# EAGLE design TriggerBoard (EAGLE 6.5.0)
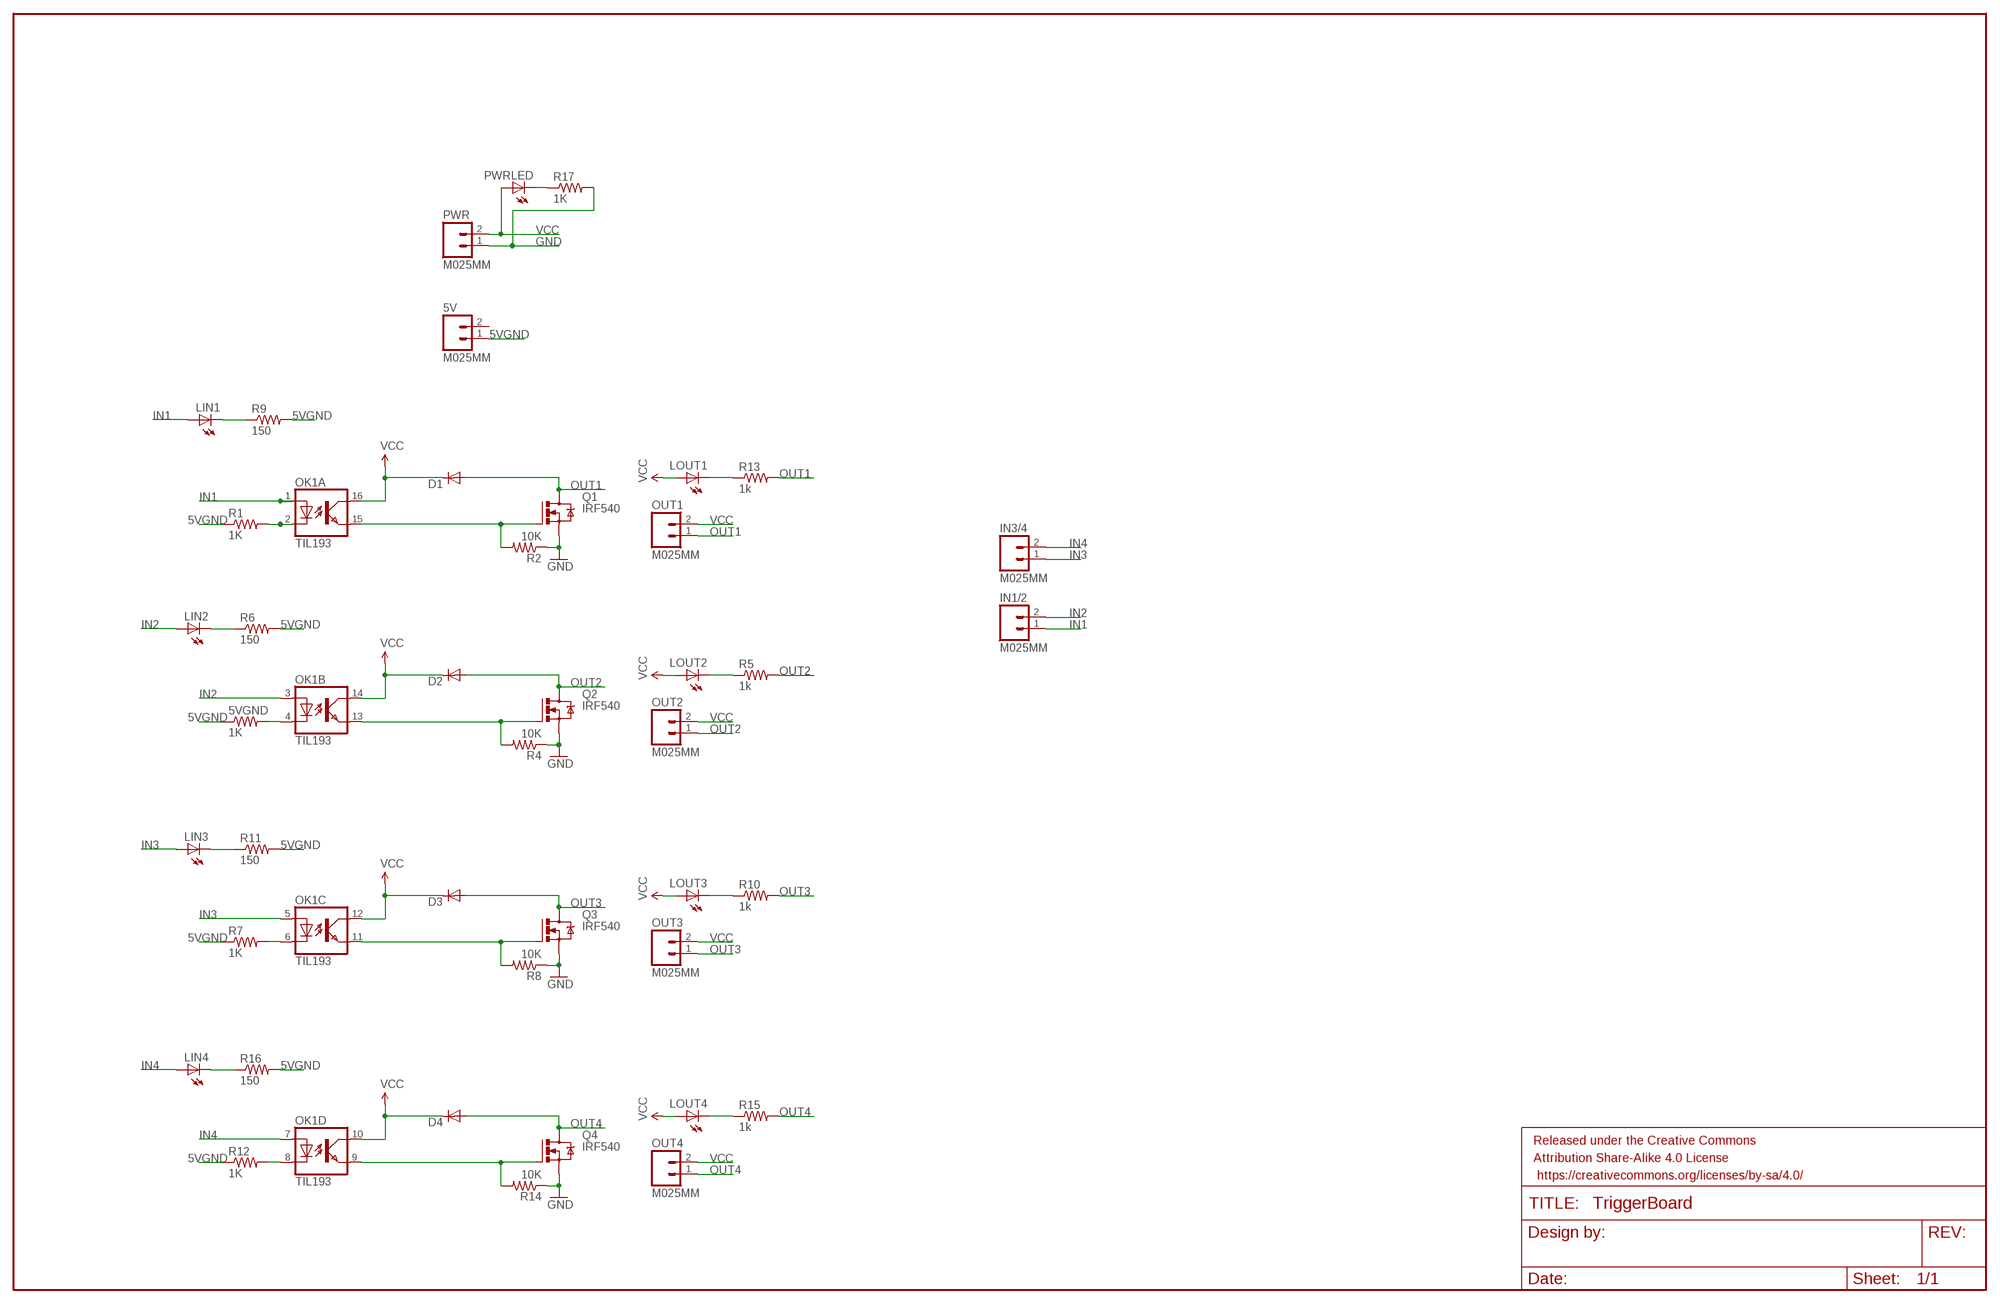
[diagram p0: schematic, sheet 1]

## Parts
5V  M025MM  [SCREWTERMINAL-5MM-2]
5VGND  1K  RESISTORPTH-1/4W  [AXIAL-0.4]
D1  DIODEPTH  [DIODE-1N4001]
D2  DIODEPTH  [DIODE-1N4001]
D3  DIODEPTH  [DIODE-1N4001]
D4  DIODEPTH  [DIODE-1N4001]
FRAME1  FRAME-LEDGER  [CREATIVE_COMMONS]
IN1/2  M025MM  [SCREWTERMINAL-5MM-2]
IN3/4  M025MM  [SCREWTERMINAL-5MM-2]
LIN1  LED3MM  [LED3MM]
LIN2  LED3MM  [LED3MM]
LIN3  LED3MM  [LED3MM]
LIN4  LED3MM  [LED3MM]
LOUT1  LED3MM  [LED3MM]
LOUT2  LED3MM  [LED3MM]
LOUT3  LED3MM  [LED3MM]
LOUT4  LED3MM  [LED3MM]
OK1  TIL193  [DIL16]
OUT1  M025MM  [SCREWTERMINAL-5MM-2]
OUT2  M025MM  [SCREWTERMINAL-5MM-2]
OUT3  M025MM  [SCREWTERMINAL-5MM-2]
OUT4  M025MM  [SCREWTERMINAL-5MM-2]
PWR  M025MM  [SCREWTERMINAL-5MM-2]
PWRLED  LED5MM  [LED5MM]
Q1  IRF540  [TO220BV]
Q2  IRF540  [TO220BV]
Q3  IRF540  [TO220BV]
Q4  IRF540  [TO220BV]
R1  1K  RESISTORPTH-1/4W  [AXIAL-0.4]
R2  10K  RESISTORPTH-1/4W  [AXIAL-0.4]
R4  10K  RESISTORPTH-1/4W  [AXIAL-0.4]
R5  1k  RESISTORPTH-1/4W  [AXIAL-0.4]
R6  150  RESISTORPTH-1/4W  [AXIAL-0.4]
R7  1K  RESISTORPTH-1/4W  [AXIAL-0.4]
R8  10K  RESISTORPTH-1/4W  [AXIAL-0.4]
R9  150  RESISTORPTH-1/4W  [AXIAL-0.4]
R10  1k  RESISTORPTH-1/4W  [AXIAL-0.4]
R11  150  RESISTORPTH-1/4W  [AXIAL-0.4]
R12  1K  RESISTORPTH-1/4W  [AXIAL-0.4]
R13  1k  RESISTORPTH-1/4W  [AXIAL-0.4]
R14  10K  RESISTORPTH-1/4W  [AXIAL-0.4]
R15  1k  RESISTORPTH-1/4W  [AXIAL-0.4]
R16  150  RESISTORPTH-1/4W  [AXIAL-0.4]
R17  1K  RESISTORPTH-1/4W  [AXIAL-0.4]

## Nets
5VGND: 5V.1 5VGND.P$1 R1.P$1 R6.P$2 R7.P$1 R9.P$2 R11.P$2 R12.P$1 R16.P$2
GND: PWR.1 Q1.S Q2.S Q3.S Q4.S R2.P$1 R4.P$1 R8.P$1 R14.P$1 R17.P$2
IN1: IN1/2.1 LIN1.A OK1.1(A:A)
IN2: IN1/2.2 LIN2.A OK1.3(B:A)
IN3: IN3/4.1 LIN3.A OK1.5(C:A)
IN4: IN3/4.2 LIN4.A OK1.7(D:A)
N$1: LOUT1.K(C) R13.P$1
N$2: 5VGND.P$2 OK1.4(B:C)
N$3: LIN1.K(C) R9.P$1
N$4: OK1.15(A:EMIT) Q1.G R2.P$2
N$5: OK1.13(B:EMIT) Q2.G R4.P$2
N$6: OK1.2(A:C) R1.P$2
N$7: LOUT2.K(C) R5.P$1
N$8: LIN2.K(C) R6.P$1
N$9: OK1.11(C:EMIT) Q3.G R8.P$2
N$10: LOUT3.K(C) R10.P$1
N$11: OK1.6(C:C) R7.P$2
N$12: LIN3.K(C) R11.P$1
N$13: OK1.9(D:EMIT) Q4.G R14.P$2
N$14: LOUT4.K(C) R15.P$1
N$15: OK1.8(D:C) R12.P$2
N$16: LIN4.K(C) R16.P$1
N$17: PWRLED.K(C) R17.P$1
OUT1: D1.A OUT1.1 Q1.D R13.P$2
OUT2: D2.A OUT2.1 Q2.D R5.P$2
OUT3: D3.A OUT3.1 Q3.D R10.P$2
OUT4: D4.A OUT4.1 Q4.D R15.P$2
VCC: D1.C D2.C D3.C D4.C LOUT1.A LOUT2.A LOUT3.A LOUT4.A OK1.10(D:COL) OK1.12(C:COL) OK1.14(B:COL) OK1.16(A:COL) OUT1.2 OUT2.2 OUT3.2 OUT4.2 PWR.2 PWRLED.A
Unconnected: 5V.2

## Library data of the parts
5V IN1/2 IN3/4 OUT1-OUT4 PWR = SparkFun-Connectors:M02: Standard 2-pin 0.1" header. Use with - straight break away headers ( PRT-00116) - right angle break away headers (PRT-00553) - swiss pins (PRT-00743) - machine pins (PRT-00117) - female headers (PRT-00115) Molex polarized connector foot print use with: PRT-08233 with associated crimp pins and housings. 2.54_SCREWTERM for use with PRT-10571. 3.5mm Screw Terminal footprints for PRT-08084 5mm Screw Terminal footprints for use with PRT-08433
5VGND R1 R2 R4-R17 = SparkFun-Resistors:RESISTOR: Resistor Basic schematic elements and footprints for 0603, 1206, and PTH resistors.
D1-D4 = SparkFun-DiscreteSemi:DIODE: Diode These are standard reverse protection diodes and small signal diodes. SMA package can handle up to about 1A. SOD-323 can handle about 200mA. What the SOD-323 package when ordering, there are some mfgs out there that are 5-pin packages.
FRAME1 = SparkFun-Aesthetics:FRAME-LEDGER: Schematic Frame Standard 11x14 US Ledger frame
LIN1-LIN4 LOUT1-LOUT4 PWRLED = SparkFun-LED:LED: LEDs Standard schematic elements and footprints for 5mm, 3mm, 1206, and 0603 sized LEDs. 5mm - Spark Fun Electronics SKU : COM-00529 (and others)
OK1 = optocoupler:TIL193: TEXAS INSTRUMENTS OPTO COUPLER; OC_FARNELL: 1683365; OC_NEWARK: unknown
Q1-Q4 = transistor-power:IRF540: HEXFET Power MOSFET

## Board
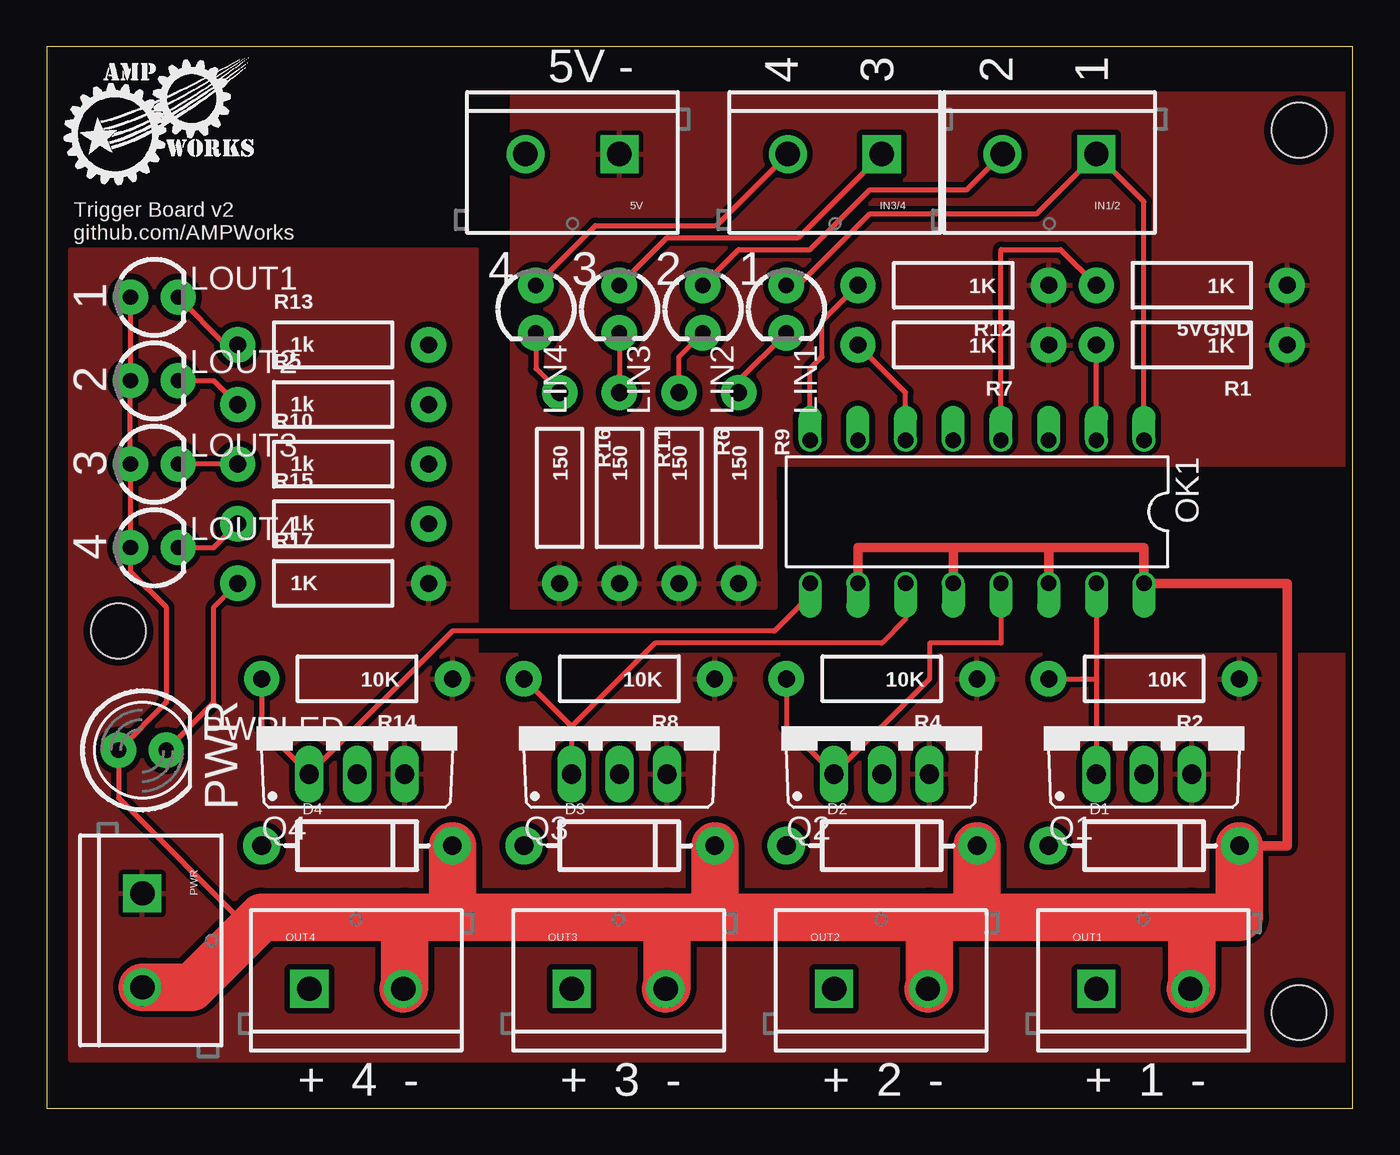
[diagram p1: board, top side]
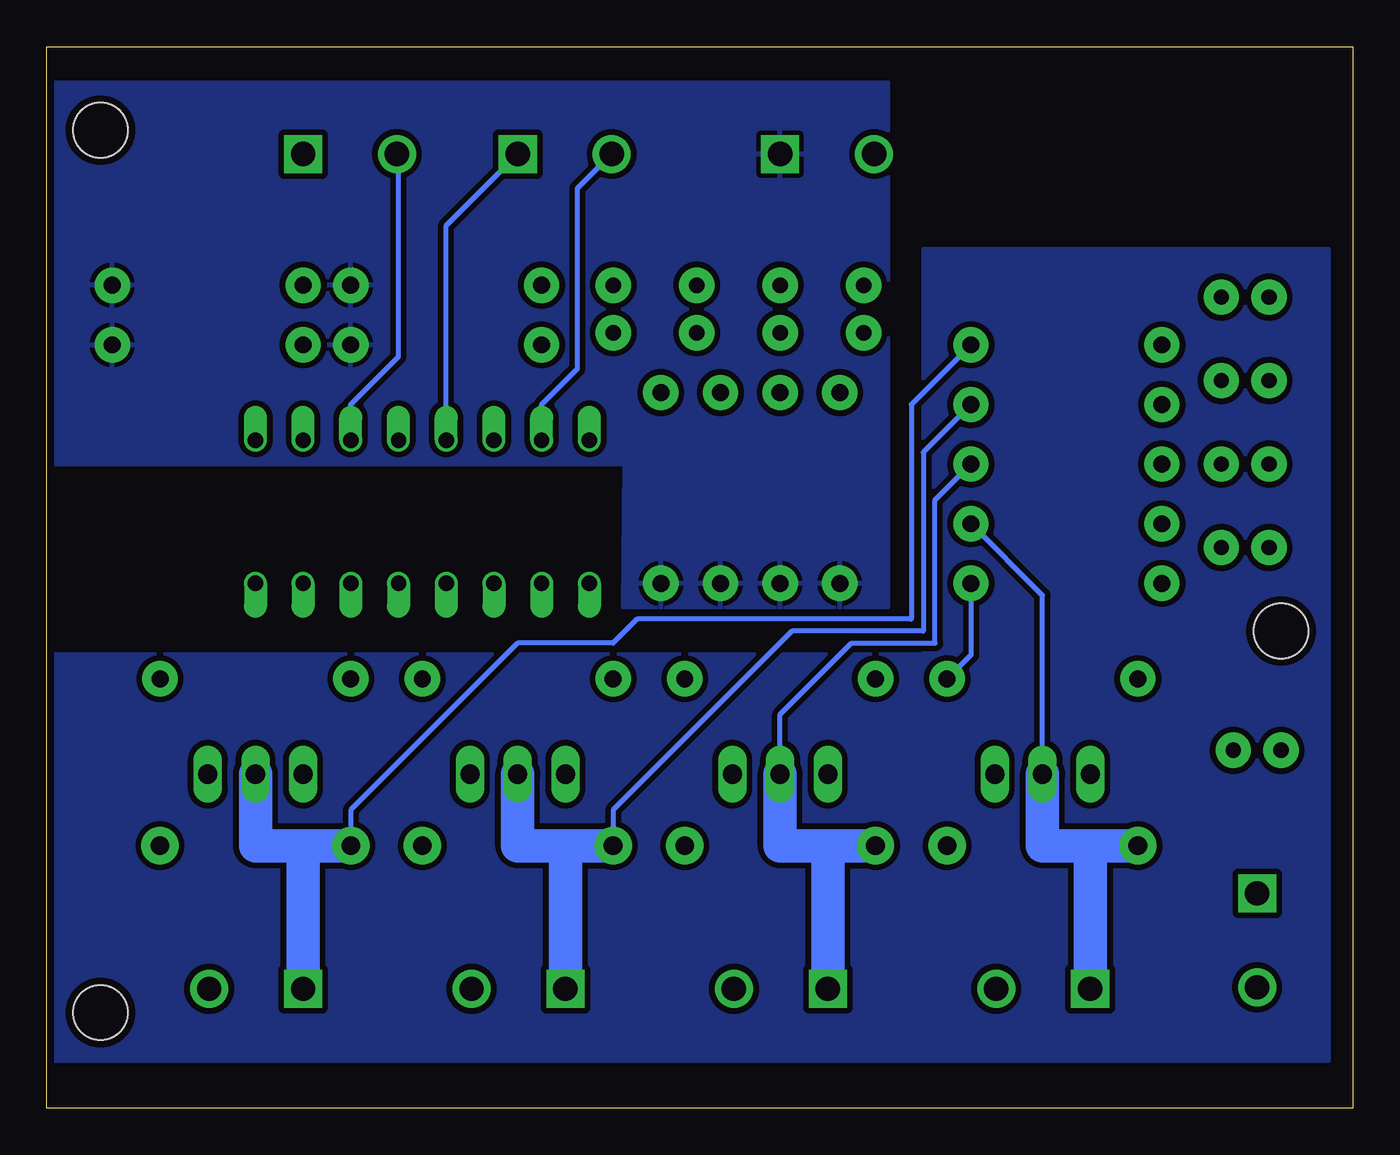
[diagram p2: board, bottom side, seen from below]

Size 69.52 x 56.51 mm. Coordinates in mm from the lower left corner, seen from the top.
Outline: 0,0 69.52,0 69.52,56.51 0,56.51 0,0
Copper layers (1*16): Top 0.0356mm / dielectric 1.5011mm / Bottom 0.0356mm
Design rules "OSHParkDesignRules": minimum track width 6mil, minimum drill 13mil, track to track 6mil, track to pad 6mil, pad to pad 6mil, via to via 6mil, smd to smd 6mil, copper to edge 15mil, drill to drill 6mil, minimum pad ring 7mil, minimum via ring 7mil, stop-mask expansion 3mil, vias tented up to drill 0mil, thermal gap 10mil
Holes 2.92 mm at 66.67,52.07 66.67,5.08 3.81,25.4

### Footprints (pad centres in the part's own frame; a part is rotated, then mirrored left to right if it is on the bottom)
SCREWTERMINAL-5MM-2 = drill 1.3 pad 2.032 square: 1 0,0 | drill 1.3 pad 2.032: 2 5,0
AXIAL-0.4 = drill 0.9 pad 1.88: P$1 -5.08,0; P$2 5.08,0
DIODE-1N4001 = drill 1 pad 1.981: A -5.08,0; C 5.08,0
LED3MM = drill 0.813 pad 1.88: A -1.27,0; K 1.27,0
DIL16 = drill 0.813 offset: 1 -8.89,-3.81; 2 -6.35,-3.81; 3 -3.81,-3.81; 4 -1.27,-3.81; 5 1.27,-3.81; 6 3.81,-3.81; 7 6.35,-3.81; 8 8.89,-3.81; 9 8.89,3.81; 10 6.35,3.81; 11 3.81,3.81; 12 1.27,3.81; 13 -1.27,3.81; 14 -3.81,3.81; 15 -6.35,3.81; 16 -8.89,3.81
LED5MM = drill 0.813 pad 1.88: A -1.27,0; K 1.27,0
TO220BV = drill 1.016 long: D 0,-2.54; G -2.54,-2.54; S 2.54,-2.54

### Placement (x,y rotation side)
5V  30.48,50.8 180 top
5VGND  60.96,43.81 180 top
D1  58.42,13.97 0 top
D2  44.45,13.97 0 top
D3  30.48,13.97 0 top
D4  16.51,13.97 0 top
FRAME1  27.94,-8.89 0 top  (outside the outline)
IN1/2  55.88,50.8 180 top
IN3/4  44.45,50.8 180 top
LIN1  39.37,42.55 270 top
LIN2  34.93,42.55 270 top
LIN3  30.48,42.55 270 top
LIN4  26.04,42.55 270 top
LOUT1  5.71,43.18 0 top
LOUT2  5.71,38.73 0 top
LOUT3  5.71,34.29 0 top
LOUT4  5.71,29.84 0 top
OK1  49.53,31.75 180 top
OUT1  55.88,6.35 0 top
OUT2  41.91,6.35 0 top
OUT3  27.94,6.35 0 top
OUT4  13.97,6.35 0 top
PWR  5.08,11.43 270 top
PWRLED  5.08,19.05 0 top
Q1  58.42,20.32 0 top
Q2  44.45,20.32 0 top
Q3  30.48,20.32 0 top
Q4  16.51,20.32 0 top
R1  60.96,40.64 180 top
R2  58.42,22.86 180 top
R4  44.45,22.86 180 top
R5  15.24,37.46 0 top
R6  33.66,33.02 270 top
R7  48.26,40.64 180 top
R8  30.48,22.86 180 top
R9  36.83,33.02 270 top
R10  15.24,34.29 0 top
R11  30.48,33.02 270 top
R12  48.26,43.81 180 top
R13  15.24,40.64 0 top
R14  16.51,22.86 180 top
R15  15.24,31.11 0 top
R16  27.3,33.02 270 top
R17  15.24,27.94 0 top

### Tracks (layer width: path | path; a pad name or v marks a point on that pad's centre or on a via)
5VGND
  pour Top (isolate 0.305): 24.77,26.67 38.79,26.67 38.74,34.29 69.21,34.29 69.21,53.98 24.77,53.98
  pour Bottom (isolate 0.305): 24.77,26.67 38.81,26.64 38.74,34.29 69.21,34.29 69.21,54.61 24.77,54.61
GND
  Bottom 0.254: R17.P$2 20.32,24.13 R14.P$1
  pour Top (isolate 0.305): 1.27,45.72 22.86,45.72 22.86,24.13 69.21,24.13 69.21,2.54 1.27,2.54
IN1
  Top 0.254: LIN1.A 40.01,43.81 43.82,47.62 52.71,47.62 IN1/2.1 58.42,48.26 OK1.1
IN2
  Top 0.254: LIN2.A 36.83,45.72 40.64,45.72 43.82,48.89 48.98,48.89 IN1/2.2
  Bottom 0.254: OK1.3 53.34,37.46 50.8,40.01 50.8,50.72 IN1/2.2
IN3
  Top 0.254: LIN3.A 33.02,46.35 40.01,46.35 IN3/4.1
  Bottom 0.254: OK1.5 48.26,46.99 IN3/4.1
IN4
  Top 0.254: LIN4.A 29.21,46.99 35.64,46.99 IN3/4.2
  Bottom 0.254: OK1.7 43.18,37.46 41.28,39.37 41.28,48.98 IN3/4.2
N$1
  Top 0.254: R13.P$1 9.53,40.64 LOUT1.K
N$2
  Top 0.254: OK1.4 50.8,45.72 53.98,45.72 5VGND.P$2
N$3
  Top 0.254: R9.P$1 36.83,38.73 LIN1.K
N$4
  Top 0.254: OK1.15 55.88,22.86 | 55.88,22.86 Q1.G | R2.P$2 55.88,22.86
N$5
  Top 0.254: OK1.13 50.8,24.77 46.99,24.77 46.99,22.86 Q2.G 39.37,20.32 R4.P$2
N$6
  Top 0.254: OK1.2 R1.P$2
N$7
  Top 0.254: LOUT2.K 8.89,38.73 R5.P$1
N$8
  Top 0.254: R6.P$1 33.66,40.01 LIN2.K
N$9
  Top 0.254: OK1.11 45.72,26.04 44.45,24.77 32.38,24.77 27.94,20.32 | 27.94,20.32 Q3.G | R8.P$2 27.94,20.32
N$10
  Top 0.254: R10.P$1 LOUT3.K
N$11
  Top 0.254: OK1.6 45.72,38.1 R7.P$2
N$12
  Top 0.254: LIN3.K R11.P$1
N$13
  Top 0.254: OK1.9 40.64,27.3 38.74,25.4 21.59,25.4 Q4.G 11.43,20.32 R14.P$2
N$14
  Top 0.254: LOUT4.K 8.89,29.84 R15.P$1
N$15
  Top 0.254: OK1.8 40.64,39.37 41.28,40.01 41.28,41.91 R12.P$2
N$16
  Top 0.254: LIN4.K 26.04,39.37 R16.P$1
N$17
  Top 0.254: PWRLED.K 8.89,21.59 8.89,26.67 R17.P$1
N$18
  pour Bottom (isolate 0.305): 1.27,45.72 22.86,45.72 22.86,24.13 69.21,24.13 69.21,2.54 1.27,2.54
OUT1
  Bottom 0.254: R13.P$2 23.5,37.46 23.5,26.04 38.1,26.04 39.37,24.77 44.45,24.77 53.34,15.88 D1.A
  Bottom 1.778: OUT1.1 55.88,13.97 D1.A 58.42,13.97 Q1.D
OUT2
  Bottom 0.254: R5.P$2 22.86,34.92 22.86,25.4 29.84,25.4 39.37,15.88 D2.A
  Bottom 1.778: OUT2.1 41.91,13.97 D2.A 44.45,13.97 Q2.D
OUT3
  Bottom 0.254: Q3.D 30.48,20.95 26.67,24.77 22.22,24.77 22.22,32.38 R10.P$2
  Bottom 1.778: OUT3.1 27.94,13.97 D3.A 30.48,13.97 Q3.D
OUT4
  Bottom 0.254: Q4.D 16.51,27.3 R15.P$2
  Bottom 1.778: OUT4.1 13.97,13.97 D4.A 16.51,13.97 Q4.D
VCC
  Top 0.254: 10.79,9.53 3.81,16.51 PWRLED.A 6.35,21.59 6.35,26.67 4.45,28.57 LOUT4.A LOUT3.A LOUT2.A LOUT1.A
  Top 0.508: OK1.14 53.34,29.84 | 53.34,29.84 48.26,29.84 | OK1.12 48.26,29.84 | 48.26,29.84 43.18,29.84 OK1.10 | D1.C 66.04,13.97 66.04,27.94 OK1.16 58.42,29.84 53.34,29.84
  Top 2.54: PWR.2 7.7,6.43 10.79,9.53 11.43,10.16 19.05,10.16 | 19.05,10.16 19.05,6.43 OUT4.2 | 19.05,10.16 21.59,10.16 | 21.59,10.16 33.02,10.16 | 33.02,10.16 33.02,6.43 OUT3.2 | 33.02,10.16 35.56,10.16 | 35.56,10.16 46.99,10.16 | 46.99,10.16 46.99,6.43 OUT2.2 | 46.99,10.16 49.53,10.16 | 49.53,10.16 60.96,10.16 | 60.96,10.16 60.96,6.43 OUT1.2 | D4.C 21.59,10.16 | D3.C 35.56,10.16 | D2.C 49.53,10.16 | 60.96,10.16 63.5,10.16 D1.C

### Text on the board
tPlace: 5V - | 4 | 3 | 2 | 1 | Trigger Board v2 | github.com/AMPWorks | 4 | 3 | 2 | 1 | 1 | 2 | 3 | 4 | PWR | + 4 - | + 3 - | + 2 - | + 1 -